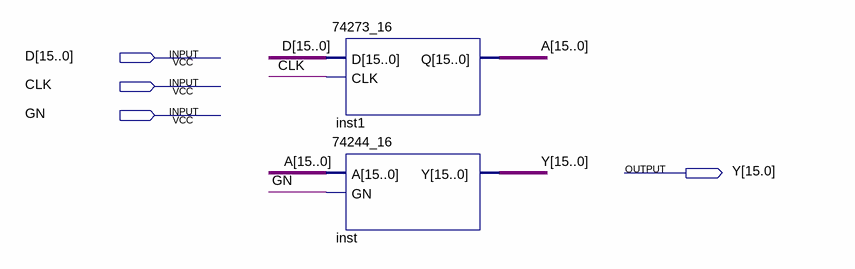
[diagram p0: schematic sheet]
// Quartus schematic Bus_Latch.bdf as structural Verilog: 2 symbols, 4 pins
module Bus_Latch (
  input  [15:0] D,
  input  CLK,
  input  GN,
  output \Y[15.0] 
);

  wire [15:0] A, Y;

  \74273_16  inst1 (.D(D), .CLK(CLK), .Q(A));
  \74244_16  inst (.A(A), .GN(GN), .Y(Y));
endmodule
